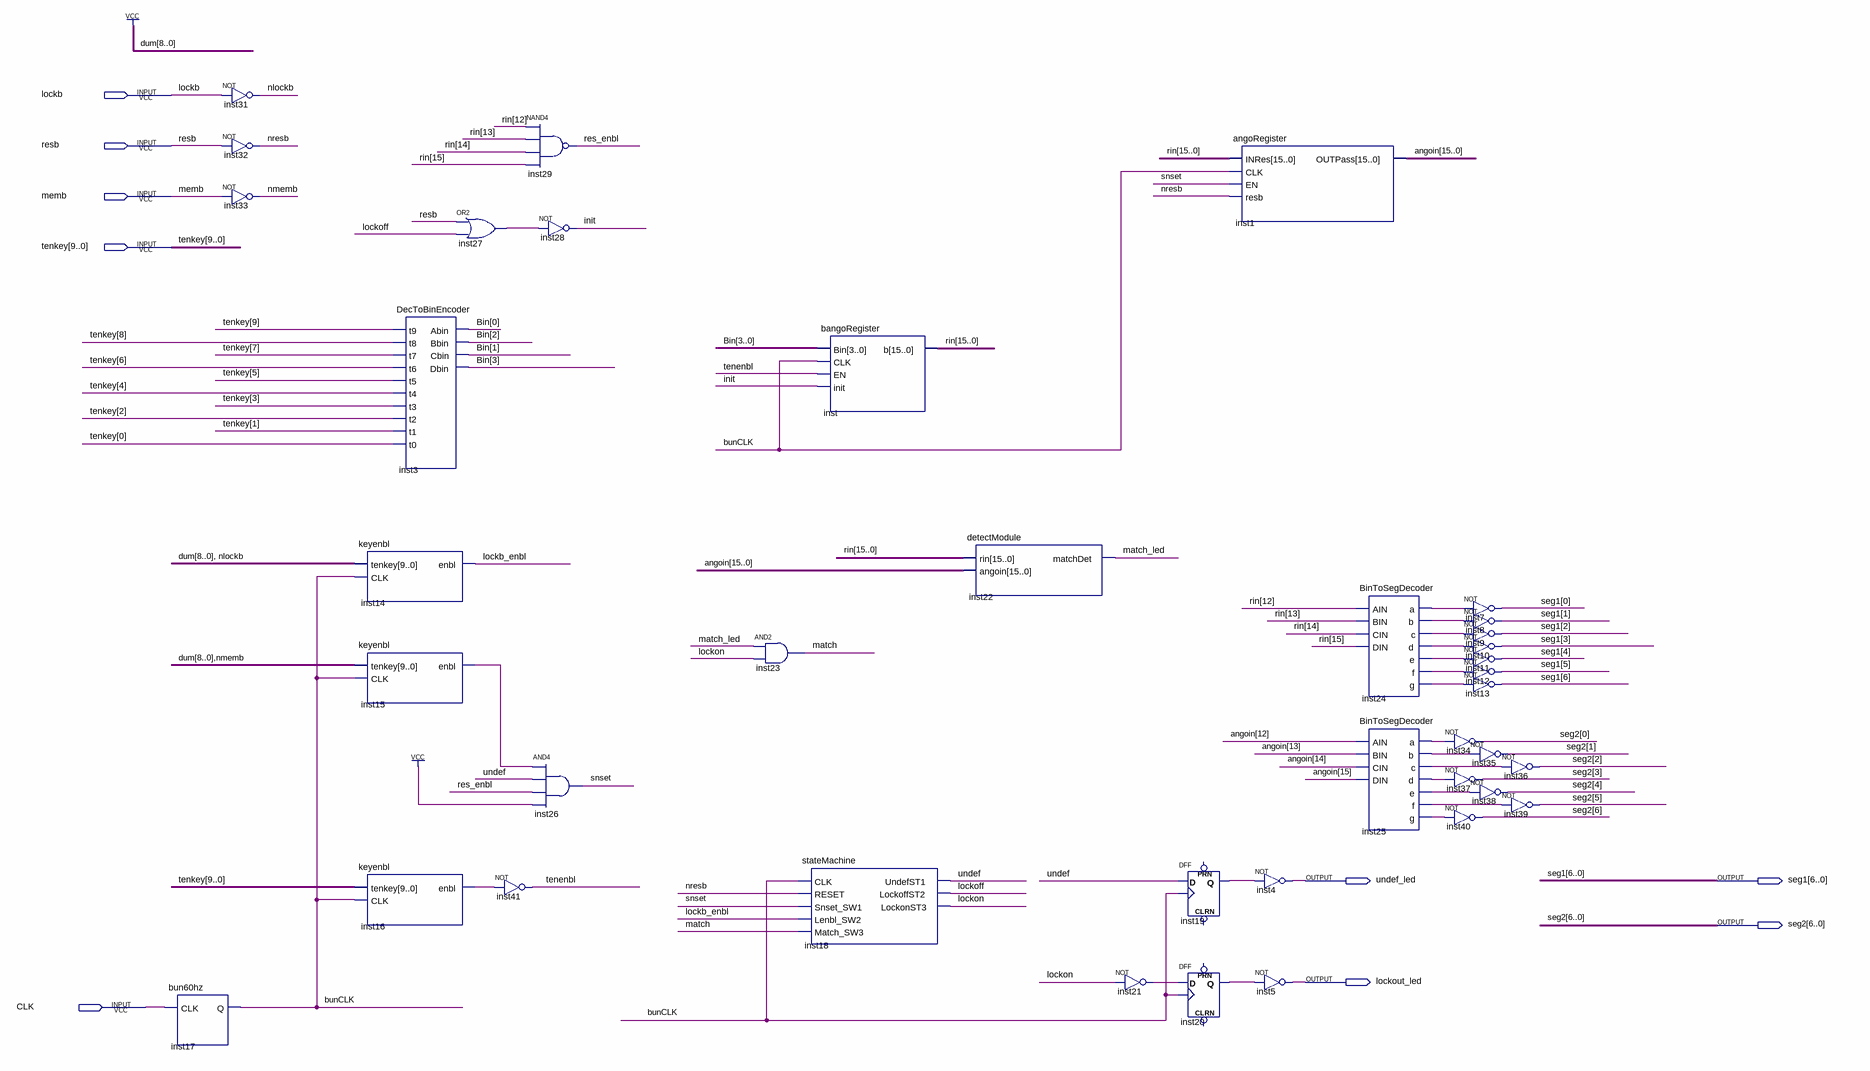
[diagram p0: schematic sheet]
// Quartus schematic denshilock.bdf as structural Verilog: 39 symbols, 9 pins
module denshilock (
  input  lockb,
  input  resb,
  input  memb,
  input  [9:0] tenkey,
  input  CLK,
  output undef_led,
  output [6:0] seg1,
  output [6:0] seg2,
  output lockout_led
);

  wire bunCLK, init, inst15_enbl, inst16_enbl, inst19_q, inst20_q, inst21_out, inst24_a, inst24_b, inst24_c,
       inst24_d, inst24_e, inst24_f, inst24_g, inst25_a, inst25_b, inst25_c, inst25_d, inst25_e, inst25_f,
       inst25_g, inst27_out, lockb_enbl, lockoff, lockon, match, match_led, nlockb, nmemb, nresb, res_enbl,
       snset, tenenbl, undef;
  wire [3:0] Bin;
  wire [15:0] angoin, rin;

  bun60hz inst17 (.CLK(CLK), .Q(bunCLK));
  not inst31 (nlockb, lockb);
  not inst32 (nresb, resb);
  not inst33 (nmemb, memb);
  DecToBinEncoder inst3 (
    .t9(tenkey[9]), .t8(tenkey[8]), .t7(tenkey[7]), .t6(tenkey[6]), .t5(tenkey[5]), .t4(tenkey[4]),
    .t3(tenkey[3]), .t2(tenkey[2]), .t1(tenkey[1]), .t0(tenkey[0]), .Abin(Bin[0]), .Bbin(Bin[2]),
    .Cbin(Bin[1]), .Dbin(Bin[3]));
  keyenbl inst14 (.tenkey({{9{1'b1}}, nlockb}), .CLK(bunCLK), .enbl(lockb_enbl));
  keyenbl inst15 (.tenkey({{9{1'b1}}, nmemb}), .CLK(bunCLK), .enbl(inst15_enbl));
  keyenbl inst16 (.tenkey(tenkey), .CLK(bunCLK), .enbl(inst16_enbl));
  or inst27 (inst27_out, resb, lockoff);
  not inst41 (tenenbl, inst16_enbl);
  nand inst29 (res_enbl, rin[12], rin[13], rin[14], rin[15]);
  not inst28 (init, inst27_out);
  and inst26 (snset, inst15_enbl, undef, res_enbl, 1'b1);
  and inst23 (match, match_led, lockon);
  stateMachine inst18 (
    .CLK(bunCLK), .RESET(nresb), .Snset_SW1(snset), .Lenbl_SW2(lockb_enbl), .Match_SW3(match),
    .UndefST1(undef), .LockoffST2(lockoff), .LockonST3(lockon));
  bangoRegister inst (.Bin(Bin), .CLK(bunCLK), .EN(tenenbl), .init(init), .b(rin));
  detectModule inst22 (.rin(rin), .angoin(angoin), .matchDet(match_led));
  not inst21 (inst21_out, lockon);
  DFF inst19 (.CLK(bunCLK), .D(undef), .Q(inst19_q));  // open: CLRN, PRN
  DFF inst20 (.CLK(bunCLK), .D(inst21_out), .Q(inst20_q));  // open: CLRN, PRN
  angoRegister inst1 (.INRes(rin), .CLK(bunCLK), .EN(snset), .resb(nresb), .OUTPass(angoin));
  not inst4 (undef_led, inst19_q);
  not inst5 (lockout_led, inst20_q);
  BinToSegDecoder inst24 (
    .AIN(rin[12]), .BIN(rin[13]), .CIN(rin[14]), .DIN(rin[15]), .a(inst24_a), .b(inst24_b), .c(inst24_c),
    .d(inst24_d), .e(inst24_e), .f(inst24_f), .g(inst24_g));
  BinToSegDecoder inst25 (
    .AIN(angoin[12]), .BIN(angoin[13]), .CIN(angoin[14]), .DIN(angoin[15]), .a(inst25_a), .b(inst25_b),
    .c(inst25_c), .d(inst25_d), .e(inst25_e), .f(inst25_f), .g(inst25_g));
  not inst7 (seg1[0], inst24_a);
  not inst8 (seg1[1], inst24_b);
  not inst9 (seg1[2], inst24_c);
  not inst10 (seg1[3], inst24_d);
  not inst11 (seg1[4], inst24_e);
  not inst12 (seg1[5], inst24_f);
  not inst13 (seg1[6], inst24_g);
  not inst34 (seg2[0], inst25_a);
  not inst37 (seg2[3], inst25_d);
  not inst40 (seg2[6], inst25_g);
  not inst35 (seg2[1], inst25_b);
  not inst36 (seg2[2], inst25_c);
  not inst38 (seg2[4], inst25_e);
  not inst39 (seg2[5], inst25_f);
endmodule
